# EAGLE design PCB-SENNHEISER_CHARGER_readout (EAGLE 6.5.0)

## Sheet 1 of 2
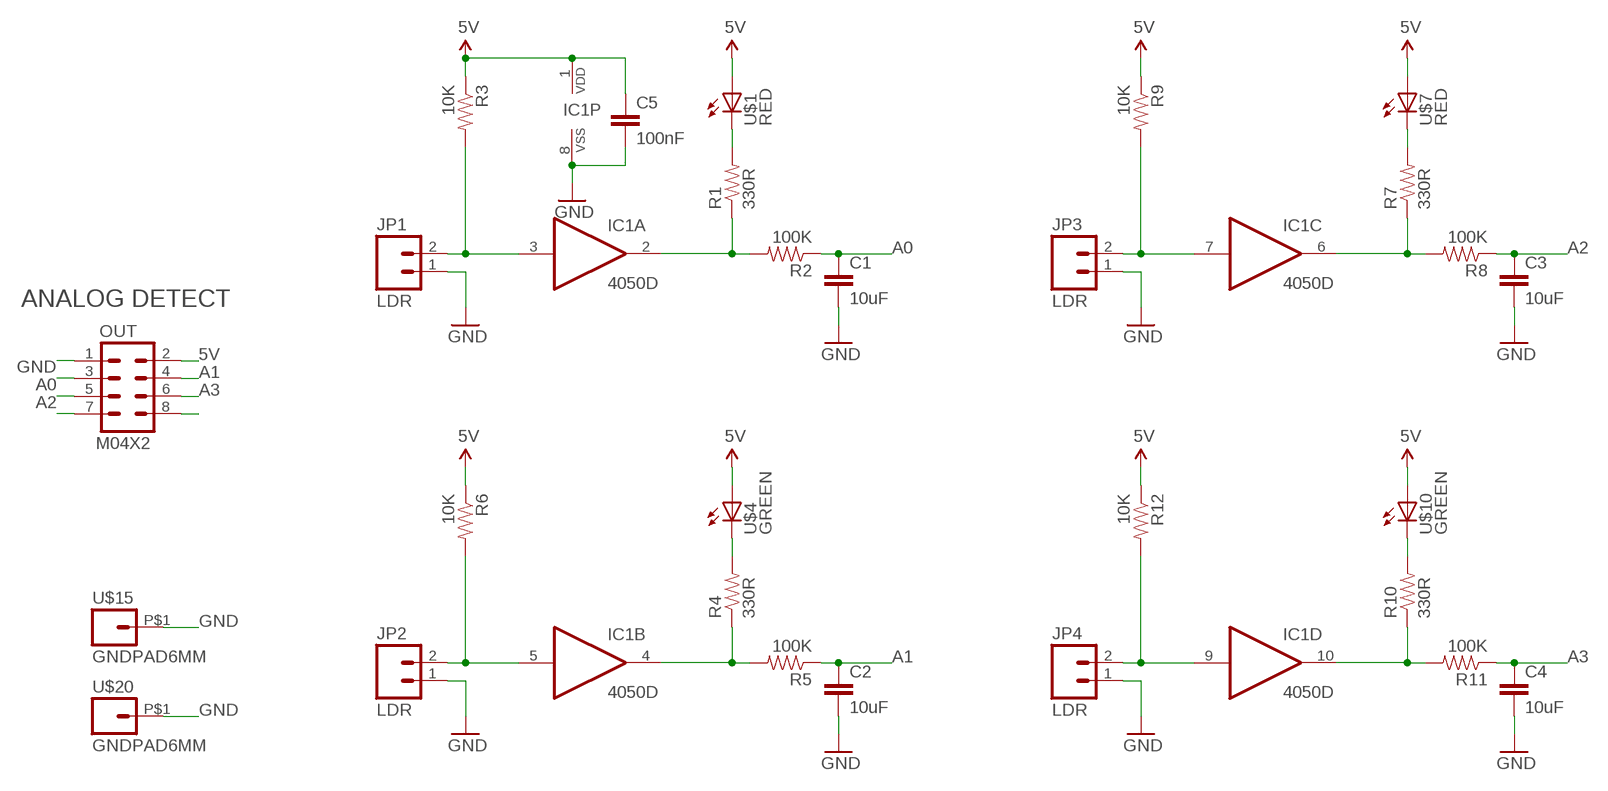
[diagram p0: schematic, sheet 1]

### Parts
C1  10uF  CAP0603-CAP  [0603-CAP]
C2  10uF  CAP0603-CAP  [0603-CAP]
C3  10uF  CAP0603-CAP  [0603-CAP]
C4  10uF  CAP0603-CAP  [0603-CAP]
C5  100nF  CAP0603-CAP  [0603-CAP]
IC1  4050D  [SO16]
JP1  LDR  M02PTH  [1X02]
JP2  LDR  M02PTH  [1X02]
JP3  LDR  M02PTH  [1X02]
JP4  LDR  M02PTH  [1X02]
OUT  M04X2  [2X4]
R1  330R  RESISTOR0603-RES  [0603-RES]
R2  100K  RESISTOR0603-RES  [0603-RES]
R3  10K  RESISTOR0603-RES  [0603-RES]
R4  330R  RESISTOR0603-RES  [0603-RES]
R5  100K  RESISTOR0603-RES  [0603-RES]
R6  10K  RESISTOR0603-RES  [0603-RES]
R7  330R  RESISTOR0603-RES  [0603-RES]
R8  100K  RESISTOR0603-RES  [0603-RES]
R9  10K  RESISTOR0603-RES  [0603-RES]
R10  330R  RESISTOR0603-RES  [0603-RES]
R11  100K  RESISTOR0603-RES  [0603-RES]
R12  10K  RESISTOR0603-RES  [0603-RES]
U$1  RED  LED3MM  [LED3MM]
U$4  GREEN  LED3MM  [LED3MM]
U$7  RED  LED3MM  [LED3MM]
U$10  GREEN  LED3MM  [LED3MM]
U$15  GNDPAD6MM  [3.2MMPAD6MM]
U$20  GNDPAD6MM  [3.2MMPAD6MM]

### Nets
5V [PWR]: C5.1 IC1.1(P:VDD) OUT.2 R3.1 R6.1 R9.1 R12.1 U$1.A U$4.A U$7.A U$10.A
A0: C1.1 OUT.3 R2.1
A1: C2.1 OUT.4 R5.1
A2: C3.1 OUT.5 R8.1
A3: C4.1 OUT.6 R11.1
GND [PWR]: C1.2 C2.2 C3.2 C4.2 C5.2 IC1.8(P:VSS) JP1.1 JP2.1 JP3.1 JP4.1 OUT.1 U$15.P$1 U$20.P$1
N$1: IC1.3(A:I) JP1.2 R3.2
N$2: R1.2 U$1.K(C)
N$3: IC1.2(A:O) R1.1 R2.2
N$4: IC1.5(B:I) JP2.2 R6.2
N$5: R4.2 U$4.K(C)
N$6: IC1.4(B:O) R4.1 R5.2
N$7: IC1.7(C:I) JP3.2 R9.2
N$8: R7.2 U$7.K(C)
N$9: IC1.6(C:O) R7.1 R8.2
N$10: IC1.9(D:I) JP4.2 R12.2
N$11: R10.2 U$10.K(C)
N$12: IC1.10(D:O) R10.1 R11.2
N$17: OUT.8
N$21: OUT.7
Unconnected: IC1.11(E:I) IC1.12(E:O) IC1.14(F:I) IC1.15(F:O)

### Notes on the sheet
- ANALOG DETECT

## Sheet 2 of 2

## Library data of the parts
C1-C5 = SparkFun:CAP: Capacitor Standard 0603 ceramic capacitor, and 0.1" leaded capacitor.
IC1 = 40xx:4050: Hex non-inverting BUFFER
JP1-JP4 = SparkFun:M02: Header 2 Standard 2-pin 0.1" header. Use with straight break away headers (SKU : PRT-00116), right angle break away headers (PRT-00553), swiss pins (PRT-00743), machine pins (PRT-00117), and female headers (PRT-00115). Molex polarized connector foot print use with SKU : PRT-08233 with associated crimp pins and housings.
OUT = SparkFun:M04X2
R1-R12 = SparkFun:RESISTOR: Resistor Basic schematic elements and footprints for 0603, 1206, and PTH resistors.
U$1 U$4 U$7 U$10 = SKAARHOJ:LED: KINGBRIGHT 20MM BIG LAMP
U$15 U$20 = SKAARHOJ:GNDPAD

## Net classes
0 default: width 0.203 mm, drill 0.406 mm, clearance 0.203 mm
1 PWR: width 0.406 mm, drill 0.61 mm, clearance 0.203 mm
2 RELAY LINES: width 0.305 mm, clearance 0.203 mm
3 INput lines: clearance 0.203 mm

## Board
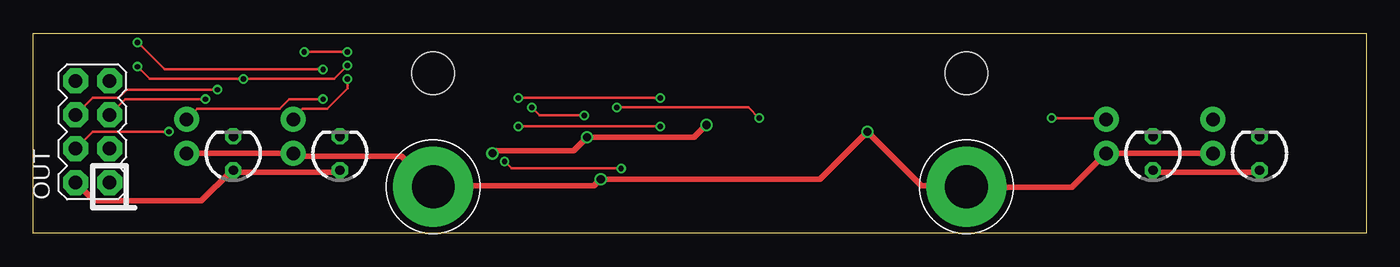
[diagram p1: board, top side]
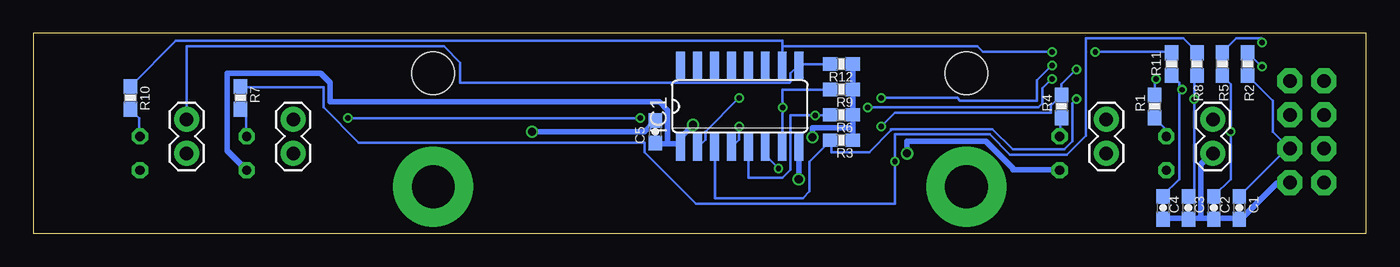
[diagram p2: board, bottom side, seen from below]

Size 100 x 15 mm. Coordinates in mm from the lower left corner, seen from the top.
Outline: 0,0 0,15 100,15 100,0 0,0
Copper layers (1*16): Top 0.035mm / dielectric 1.5mm / Bottom 0.035mm
Design rules "Fusion_eagle_rule_v1.1": minimum track width 6mil, minimum drill 12mil, track to track 6mil, track to pad 6mil, pad to pad 6mil, via to via 6mil, smd to smd 0mil, copper to edge 10mil, drill to drill 10mil, minimum pad ring 10mil, minimum via ring 6mil, stop-mask expansion 2mil, vias tented up to drill 100mil, thermal gap 10mil
Holes 3.2 mm at 30,12 70,12
tRestrict: area 24,6.5 to 36,15; area 64,6.5 to 76,15

### Footprints (pad centres in the part's own frame; a part is rotated, then mirrored left to right if it is on the bottom)
0603-CAP = smd 1.1 x 1: 1 -0.85,0; 2 0.85,0
SO16 = smd 0.66 x 2.032: 1 -4.445,-3.073; 2 -3.175,-3.073; 3 -1.905,-3.073; 4 -0.635,-3.073; 5 0.635,-3.073; 6 1.905,-3.073; 7 3.175,-3.073; 8 4.445,-3.073; 9 4.445,3.073; 10 3.175,3.073; 11 1.905,3.073; 12 0.635,3.073; 13 -0.635,3.073; 14 -1.905,3.073; 15 -3.175,3.073; 16 -4.445,3.073
1X02 = drill 1.016 pad 1.88: 1 0,0; 2 2.54,0
2X4 = drill 1.016 pad 1.88 octagon: 1 -3.81,-1.27; 2 -3.81,1.27; 3 -1.27,-1.27; 4 -1.27,1.27; 5 1.27,-1.27; 6 1.27,1.27; 7 3.81,-1.27; 8 3.81,1.27
0603-RES = smd 1.1 x 1: 1 -0.85,0; 2 0.85,0
LED3MM = drill 0.7 pad 1.2 octagon: A -1.27,0; K 1.27,0
3.2MMPAD6MM = drill 3.2 pad 6: P$1 0,0

### Placement (x,y rotation side)
C1  9.53,1.91 270 bottom
C2  11.43,1.91 270 bottom
C3  13.34,1.91 270 bottom
C4  15.24,1.91 270 bottom
C5  53.34,7.62 90 bottom
IC1  46.99,9.53 0 bottom
JP1  11.5,6 90 bottom
JP2  19.5,6 90 bottom
JP3  80.5,6 90 bottom
JP4  88.5,6 90 bottom
OUT  4.45,7.62 90 top
R1  15.88,9.53 270 bottom
R2  8.89,12.7 90 bottom
R3  39.37,6.99 180 bottom
R4  22.86,9.53 270 bottom
R5  10.79,12.7 90 bottom
R6  39.37,8.89 180 bottom
R7  84.45,10.16 270 bottom
R8  12.7,12.7 90 bottom
R9  39.37,10.79 180 bottom
R10  92.71,10.16 270 bottom
R11  14.61,12.7 90 bottom
R12  39.37,12.7 180 bottom
U$1  15,6 90 top
U$4  23,6 90 top
U$7  84,6 90 top
U$10  92,6 90 top
U$15  30,3.5 0 top
U$20  70,3.5 0 top

### Tracks (layer width: path | path; a pad name or v marks a point on that pad's centre or on a via)
5V  (via drill 0.61)
  Top 0.406: U$4.A 22.96,4.67 22.86,4.57 15.14,4.57 15.04,4.67 U$1.A 14.83,4.67 12.6,2.44 4.57,2.44 3.25,3.76 OUT.2 | U$7.A 84.02,4.67 84.12,4.57 91.85,4.57 91.95,4.67 U$10.A | v50.49,8.13 49.58,7.21 v41.55,7.21 40.54,6.2 34.65,6.2 v34.44,5.99
  Bottom 0.406: 38.51,7.92 38.51,8.84 R6.1 38.51,9.04 38.51,10.77 R9.1 38.51,10.97 38.51,12.7 R12.1 | 38.51,7.92 38.51,7.01 R3.1 | 52.43,6.71 51.51,6.71 51.51,6.5 IC1.1 51.41,6.81 51.41,7.21 v50.49,8.13 | 52.43,6.71 53.34,6.71 C5.1 | 52.43,6.71 52.43,9.25 53.03,9.86 77.72,9.86 77.72,11.28 78.44,11.99 85.45,11.99 85.45,6.2 84.02,4.78 U$7.A | 38.51,7.92 41.55,7.92 v41.55,7.21 | v34.44,5.99 34.44,6.91 28.55,6.91 26.52,4.88 26.52,4.78 23.06,4.78 U$4.A
A0
  Bottom 0.203: R2.1 8.84,11.79 7.01,9.96 7.01,7.62 5.79,6.4 OUT.3 5.89,6.4 9.45,2.85 C1.1
A1  (via drill 0.41)
  Top 0.203: v10.16,7.62 4.47,7.62 3.25,6.4 OUT.4
  Bottom 0.203: R5.1 10.77,11.79 10.16,11.18 v10.16,7.62 10.16,4.06 11.38,2.85 C2.1
A2  (via drill 0.41)
  Top 0.203: v12.9,10.06 6.91,10.06 5.79,8.94 OUT.5
  Bottom 0.203: C3.1 13.31,2.85 12.9,3.25 v12.9,10.06 12.9,11.58 12.7,11.79 R8.1
A3  (via drill 0.41)
  Top 0.203: v13.82,10.77 7.01,10.77 6.4,10.16 4.47,10.16 3.25,8.94 OUT.6
  Bottom 0.203: 14.02,10.77 14.02,11.28 14.53,11.79 R11.1 | 14.02,10.77 14.02,4.06 15.24,2.85 C4.1 | 14.02,10.77 v13.82,10.77
GND  (via drill 0.61)
  Top 0.406: JP4.1 80.57,5.99 JP3.1 80.37,5.89 77.93,3.45 70.21,3.45 U$20.P$1 69.9,3.56 66.65,3.56 v62.59,7.62 59.03,4.06 v42.57,4.06 42.06,3.56 30.07,3.56 U$15.P$1 29.87,3.56 27.64,5.79 19.71,5.79 19.61,5.89 JP2.1 19.41,5.99 11.58,5.99 JP1.1
  Bottom 0.406: v62.59,7.62 54.15,7.62 53.34,8.43 C5.2 | 12.39,1.12 11.58,1.12 C2.2 11.38,1.12 9.55,1.12 C1.2 9.35,1.12 6.71,3.76 5.79,3.76 OUT.1 | 12.39,1.12 13.31,1.12 C3.2 13.51,1.12 15.24,1.12 C4.2 | 12.39,1.12 12.39,5.18 11.58,5.99 JP1.1 | v42.57,4.06 42.57,6.4 IC1.8
N$1  (via drill 0.41)
  Top 0.203: v21.74,10.06 19.2,10.06 18.49,9.35 12.29,9.35 11.58,8.64 JP1.2
  Bottom 0.203: IC1.3 48.87,6.4 48.87,2.64 42.27,2.64 41.76,3.15 41.76,5.38 40.23,6.91 R3.2 40.13,6.91 40.13,6.1 37.29,6.1 35.66,7.72 35.66,7.82 28.04,7.82 26.52,6.3 22.66,6.3 22.05,6.91 22.05,9.75 v21.74,10.06
N$2
  Bottom 0.203: R1.2 15.85,8.64 15.04,7.82 15.04,7.32 U$1.K
N$3  (via drill 0.41)
  Top 0.203: v7.82,12.5 8.74,11.58 v15.75,11.58 22.55,11.58 v23.57,12.6 | v36.37,10.16 v47.04,10.16
  Bottom 0.203: v7.82,12.5 8.84,13.51 R2.2 | v15.75,11.58 15.85,11.48 15.85,10.46 R1.1 | v47.04,10.16 49.58,7.62 49.58,7.01 50.09,6.5 IC1.2 | v36.37,10.16 30.68,10.16 30.48,9.96 24.69,9.96 24.69,11.48 v23.57,12.6
N$4  (via drill 0.41)
  Top 0.203: v23.57,11.58 23.57,10.87 22.05,9.35 20.22,9.35 19.51,8.64 JP2.2 | v37.39,9.45 38,8.84 v41.35,8.84
  Bottom 0.203: R6.2 40.23,8.84 v41.35,8.84 43.18,8.84 43.18,4.78 43.79,4.17 46.33,4.17 46.33,6.4 IC1.5 | v23.57,11.58 24.28,10.87 24.28,9.75 24.59,9.45 v37.39,9.45
N$5
  Bottom 0.203: R4.2 22.86,8.64 22.96,8.53 22.96,7.32 U$4.K
N$6  (via drill 0.41)
  Top 0.203: v7.82,14.33 9.86,12.29 v21.74,12.29 | v36.37,8.03 v47.04,8.03
  Bottom 0.203: v7.82,14.33 7.82,14.63 9.75,14.63 10.77,13.61 R5.2 | v21.74,12.29 22.86,11.18 R4.1 22.86,10.36 23.67,9.55 23.67,9.04 35.36,9.04 v36.37,8.03 | v47.04,8.03 47.04,7.01 47.55,6.5 IC1.4
N$7  (via drill 0.41)
  Top 0.203: v76.4,8.64 80.47,8.64 JP3.2 | v54.46,8.64 53.65,9.45 v43.79,9.45
  Bottom 0.203: R9.2 40.23,10.77 43.79,10.77 v43.79,9.45 43.79,6.5 IC1.7 | v54.46,8.64 v76.4,8.64
N$8
  Bottom 0.203: R7.2 84.43,9.25 84.02,8.84 84.02,7.32 U$7.K
N$9  (via drill 0.41)
  Top 0.203: v35.36,5.38 35.87,4.88 v44.09,4.88
  Bottom 0.203: v44.09,4.88 45.01,5.79 45.01,6.4 IC1.6 | R8.2 12.7,13.61 13.72,14.63 21.03,14.63 21.03,7.32 22.45,5.89 26.72,5.89 28.25,7.42 35.36,7.42 v35.36,5.38 35.36,2.23 50.29,2.23 54.15,6.1 54.15,6.81 75.59,6.81 78.23,9.45 78.23,10.97 84.43,10.97 R7.1
N$10
  Bottom 0.203: R12.2 42.47,12.7 42.47,12.6 IC1.9 42.57,12.6 43.18,11.99 43.18,11.38 43.28,11.28 67.97,11.28 67.97,12.8 69.19,14.02 88.49,14.02 88.49,8.64 JP4.2
N$11
  Bottom 0.203: R10.2 92.66,9.25 92.05,8.64 92.05,7.32 U$10.K
N$12  (via drill 0.41)
  Top 0.203: v23.57,13.61 v20.32,13.61
  Bottom 0.203: v20.32,13.61 14.63,13.61 R11.2 | v23.57,13.61 28.75,13.61 29.16,14.02 43.79,14.02 | 43.79,14.02 43.79,12.6 IC1.10 | 43.79,14.02 43.79,14.43 89.31,14.43 92.66,11.07 R10.1